# Altium project microdevel_actel.prjpcb
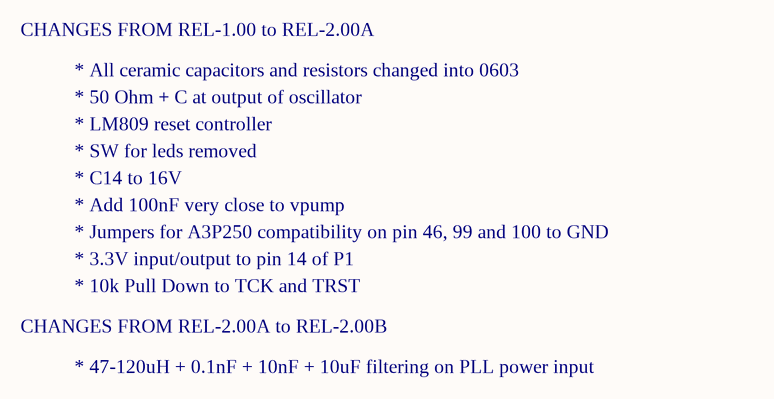
[diagram p0: changelog.schdoc]
3 sheets, 53 parts. Net scope: flat (ports and power ports of the same name join across sheets).
Board file: PCB_microdevel_actel.pcbdoc
Sheets:
  changelog.schdoc
  microdevel_actel.SchDoc
  microdevel_power.schdoc

## Sheet changelog.schdoc
size A4

### Notes on the sheet
- CHANGES FROM REL-1.00 to REL-2.00A
- * All ceramic capacitors and resistors changed into 0603
- * 50 Ohm + C at output of oscillator
- * LM809 reset controller
- * SW for leds removed
- * C14 to 16V
- * Add 100nF very close to vpump
- * Jumpers for A3P250 compatibility on pin 46, 99 and 100 to GND
- * 3.3V input/output to pin 14 of P1
- * 10k Pull Down to TCK and TRST
- CHANGES FROM REL-2.00A to REL-2.00B
- * 47-120uH + 0.1nF + 10nF + 10uF filtering on PLL power input
- Title
- Size:
- Date:
- A4
- Number:
- Time:
- Revision:
- Sheet
- of
- nbee Embedded Systems S.L.
- AV/Carlos V 45 4-D
- Móstoles (Madrid)
- 28938 SPAIN
- +34 91 1201798
- File:

## Sheet microdevel_actel.SchDoc
size A4; Revision: REL-1.1; DocumentName: A3P250 Development Board
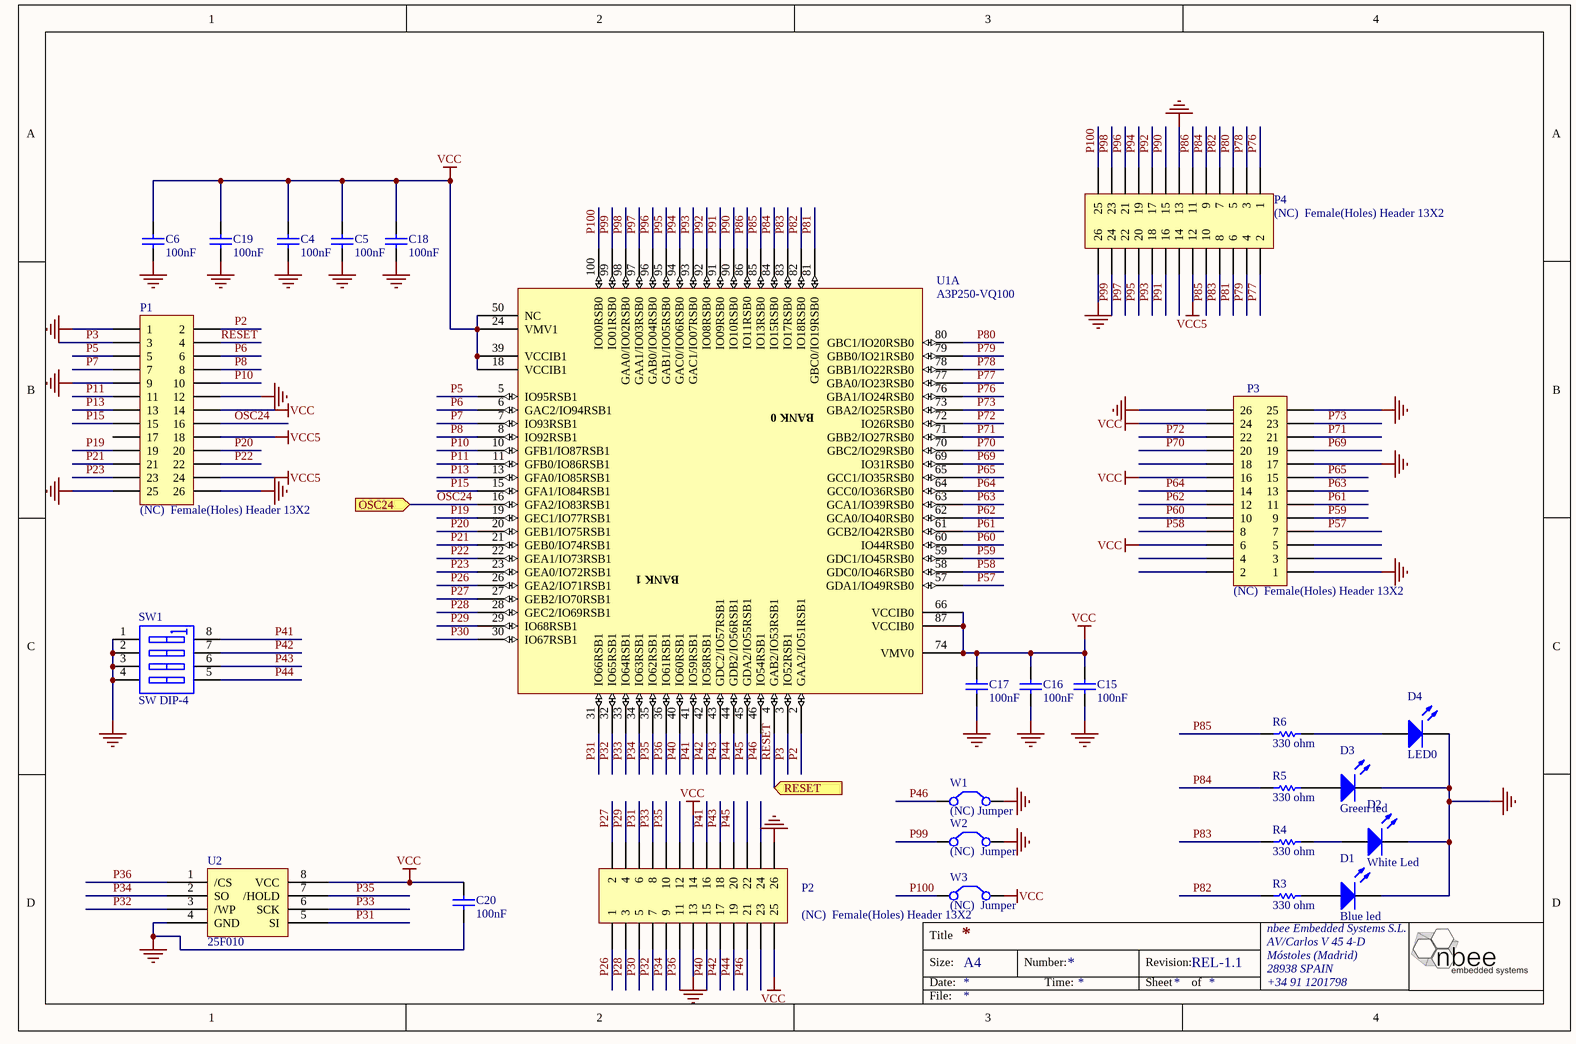
[diagram p1: microdevel_actel.SchDoc]

### Parts
C4  100nF  [0603]
C5  100nF  [0603]
C6  100nF  [0603]
C15  100nF  [0603]
C16  100nF  [0603]
C17  100nF  [0603]
C18  100nF  [0603]
C19  100nF  [0603]
C20  100nF  [0603]
D1  Blue led  [LED_0603]
D2  White Led  [LED_0603]
D3  Green led  [LED_0603]
D4  LED0  [LED_0603]
P1  (NC)  Female(Holes) Header 13X2  [HDR2X13]
P2  (NC)  Female(Holes) Header 13X2  [HDR2X13]
P3  (NC)  Female(Holes) Header 13X2  [HDR2X13]
P4  (NC)  Female(Holes) Header 13X2  [HDR2X13]
R3  330 ohm  [0603]
R4  330 ohm  [0603]
R5  330 ohm  [0603]
R6  330 ohm  [0603]
SW1  SW DIP-4  [SO8]
U1  A3P250-VQ100  [VQ100]  (part A of 2)
U2  25F010  [8S1]
W1  (NC) Jumper  [JUMPER]
W2  (NC)  Jumper  [JUMPER]
W3  (NC)  Jumper  [JUMPER]

### Ports
OSC24 (in), RESET (in)

### Nets
GND: C4.1 C5.1 C6.2 C15.1 C16.1 C17.1 C18.1 C19.1 C20.1 D1.2(K) D2.2(K) D3.2(K) D4.2(K) P1.1 P1.9 P1.12 P1.25 P1.26 P2.13 P2.26 P3.1 P3.17 P3.25 P3.26 P4.13 P4.26 SW1.1(A1) SW1.2(A2) SW1.3(A3) SW1.4(A4) U2.4(GND) W1.2(C2) W2.2(C2)
VCC: C4.2 C5.2 C6.1 C15.2 C16.2 C17.2 C18.2 C19.2 C20.2 P1.14 P2.14 P2.25 P3.6 P3.16 P3.24 U1.18(VCCIB1) U1.24(VMV1) U1.39(VCCIB1) U1.50(NC) U1.66(VCCIB0) U1.74(VMV0) U1.87(VCCIB0) U2.8(VCC) W3.2(C2)
VCC5: P1.18 P1.24 P4.12
OSC24: P1.16 U1.16(GFA2/IO83RSB1) ; port OSC24
P2: P1.2 U1.2(GAA2/IO51RSB1)
P3: P1.3 U1.3(IO52RSB1)
P5: P1.5 U1.5(IO95RSB1)
P6: P1.6 U1.6(GAC2/IO94RSB1)
P7: P1.7 U1.7(IO93RSB1)
P8: P1.8 U1.8(IO92RSB1)
P10: P1.10 U1.10(GFB1/IO87RSB1)
P11: P1.11 U1.11(GFB0/IO86RSB1)
P13: P1.13 U1.13(GFA0/IO85RSB1)
P15: P1.15 U1.15(GFA1/IO84RSB1)
P19: P1.19 U1.19(GEC1/IO77RSB1)
P20: P1.20 U1.20(GEB1/IO75RSB1)
P21: P1.21 U1.21(GEB0/IO74RSB1)
P22: P1.22 U1.22(GEA1/IO73RSB1)
P23: P1.23 U1.23(GEA0/IO72RSB1)
P26: P2.1 U1.26(GEA2/IO71RSB1)
P27: P2.2 U1.27(GEB2/IO70RSB1)
P28: P2.3 U1.28(GEC2/IO69RSB1)
P29: P2.4 U1.29(IO68RSB1)
P30: P2.5 U1.30(IO67RSB1)
P31: P2.6 U1.31(IO66RSB1) U2.5(SI)
P32: P2.7 U1.32(IO65RSB1) U2.3(/WP)
P33: P2.8 U1.33(IO64RSB1) U2.6(SCK)
P34: P2.9 U1.34(IO63RSB1) U2.2(SO)
P35: P2.10 U1.35(IO62RSB1) U2.7(/HOLD)
P36: P2.11 U1.36(IO61RSB1) U2.1(/CS)
P40: P2.15 U1.40(IO60RSB1)
P41: P2.16 SW1.8(B1) U1.41(IO59RSB1)
P42: P2.17 SW1.7(B2) U1.42(IO58RSB1)
P43: P2.18 SW1.6(B3) U1.43(GDC2/IO57RSB1)
P44: P2.19 SW1.5(B4) U1.44(GDB2/IO56RSB1)
P45: P2.20 U1.45(GDA2/IO55RSB1)
P46: P2.21 U1.46(IO54RSB1) W1.1(C1)
P57: P3.7 U1.57(GDA1/IO49RSB0)
P58: P3.8 U1.58(GDC0/IO46RSB0)
P59: P3.9 U1.59(GDC1/IO45RSB0)
P60: P3.10 U1.60(IO44RSB0)
P61: P3.11 U1.61(GCB2/IO42RSB0)
P62: P3.12 U1.62(GCA0/IO40RSB0)
P63: P3.13 U1.63(GCA1/IO39RSB0)
P64: P3.14 U1.64(GCC0/IO36RSB0)
P65: P3.15 U1.65(GCC1/IO35RSB0)
P69: P3.19 U1.69(IO31RSB0)
P70: P3.20 U1.70(GBC2/IO29RSB0)
P71: P3.21 U1.71(GBB2/IO27RSB0)
P72: P3.22 U1.72(IO26RSB0)
P73: P3.23 U1.73(GBA2/IO25RSB0)
P76: P4.1 U1.76(GBA1/IO24RSB0)
P77: P4.2 U1.77(GBA0/IO23RSB0)
P78: P4.3 U1.78(GBB1/IO22RSB0)
P79: P4.4 U1.79(GBB0/IO21RSB0)
P80: P4.5 U1.80(GBC1/IO20RSB0)
P81: P4.6 U1.81(GBC0/IO19RSB0)
P82: P4.7 R3.2 U1.82(IO18RSB0)
P83: P4.8 R4.2 U1.83(IO17RSB0)
P84: P4.9 R5.2 U1.84(IO15RSB0)
P85: P4.10 R6.2 U1.85(IO13RSB0)
P86: P4.11 U1.86(IO11RSB0)
P90: P4.15 U1.90(IO10RSB0)
P91: P4.16 U1.91(IO09RSB0)
P92: P4.17 U1.92(IO08RSB0)
P93: P4.18 U1.93(GAC1/IO07RSB0)
P94: P4.19 U1.94(GAC0/IO06RSB0)
P95: P4.20 U1.95(GAB1/IO05RSB0)
P96: P4.21 U1.96(GAB0/IO04RSB0)
P97: P4.22 U1.97(GAA1/IO03RSB0)
P98: P4.23 U1.98(GAA0/IO02RSB0)
P99: P4.24 U1.99(IO01RSB0) W2.1(C1)
P100: P4.25 U1.100(IO00RSB0) W3.1(C1)
RESET: P1.4 U1.4(GAB2/IO53RSB1) ; port RESET
NetD1_1: D1.1(A) R3.1
NetD2_1: D2.1(A) R4.1
NetD3_1: D3.1(A) R5.1
NetD4_1: D4.1(A) R6.1

Not connected (* = marked no-connect by the designer): P1 17; P2 12 22 23 24; P3 2 3 4 5 18; P4 14

### Notes on the sheet
- Title
- Size:
- Date:
- A4
- Number:
- Time:
- Revision:
- Sheet
- of
- nbee Embedded Systems S.L.
- AV/Carlos V 45 4-D
- Móstoles (Madrid)
- 28938 SPAIN
- +34 91 1201798
- File:
- (in symbol A3P060-1VQ100, part A) BANK 0; BANK 1

### Library data of the parts
C4-C6 C15-C20 = Cap Semi: Capacitor (Semiconductor SIM Model); Published: 8-Jun-2000; LatestRevisionDate: 17-Jul-2002; LatestRevisionNote: Re-released for DXP Platform.; PackageReference: C1206; Publisher: Altium Limited
D1-D3 = LED0: Typical INFRARED GaAs LED; Published: 8-Jun-2000; LatestRevisionDate: 17-Jul-2002; LatestRevisionNote: Re-released for DXP Platform.; Publisher: Altium Limited
D4 = LED0: Red Led; Published: 8-Jun-2000; LatestRevisionDate: 17-Jul-2002; LatestRevisionNote: Re-released for DXP Platform.; Publisher: Altium Limited
P1-P4 = Header 13X2: Header, 13-Pin, Dual row; LatestRevisionDate: 17-Jul-2002; LatestRevisionNote: Re-released for DXP Platform.; Publisher: Altium Limited
R3-R6 = Res1: Resistor; Published: 8-Jun-2000; LatestRevisionDate: 17-Jul-2002; LatestRevisionNote: Re-released for DXP Platform.; Publisher: Altium Limited
SW1 = SW DIP-4: DIP Switch, 4 Position, SPST; Published: 24-Mar-1999; LatestRevisionDate: 17-Jul-2002; LatestRevisionNote: Re-released for DXP Platform.; PackageReference: SO8; Publisher: Altium Limited; Code_JEDEC: MS-012-AA; Code_IPC: SO8
U1 = A3P060-1VQ100: ProASIC3 Flash Family FPGA, 71 User IOs, 60K System Gates, 18 Kbits RAM, 1 Kbit Flash ROM, 1 PLL, 100-Pin VQFP, Commercial Grade; PackageDocument: ver8.7, Jun-2004; Published: 4-Mar-2005; DatasheetDocument: Jan-2005; PackageReference: VQ100; Publisher: Altium Limited; ComponentLink1Description: Flash Devices Home Page; ComponentLink1URL: http://www.actel.com/products/pa3/index.aspx; ComponentLink2Description: Datasheet; ComponentLink2URL: http://www.actel.com/documents/PA3_DS.pdf; ComponentLink3Description: Packaging Specification; ComponentLink3URL: http://www.actel.com/documents/PckgMechDrwngs.pdf; Code_JEDEC: MS-036-AED; Code_IPC: SQFP14X14-100
W1-W3 = Jumper: Jumper Wire; Published: 24-Mar-1999; LatestRevisionDate: 17-Jul-2002; LatestRevisionNote: Re-released for DXP Platform.; PackageReference: RAD-0.2; Publisher: Altium Limited; PackageDescription: Radial Cap, Thru-Hole; 2 Leads; 0.2 in Pin Spacing

## Sheet microdevel_power.schdoc
size A4
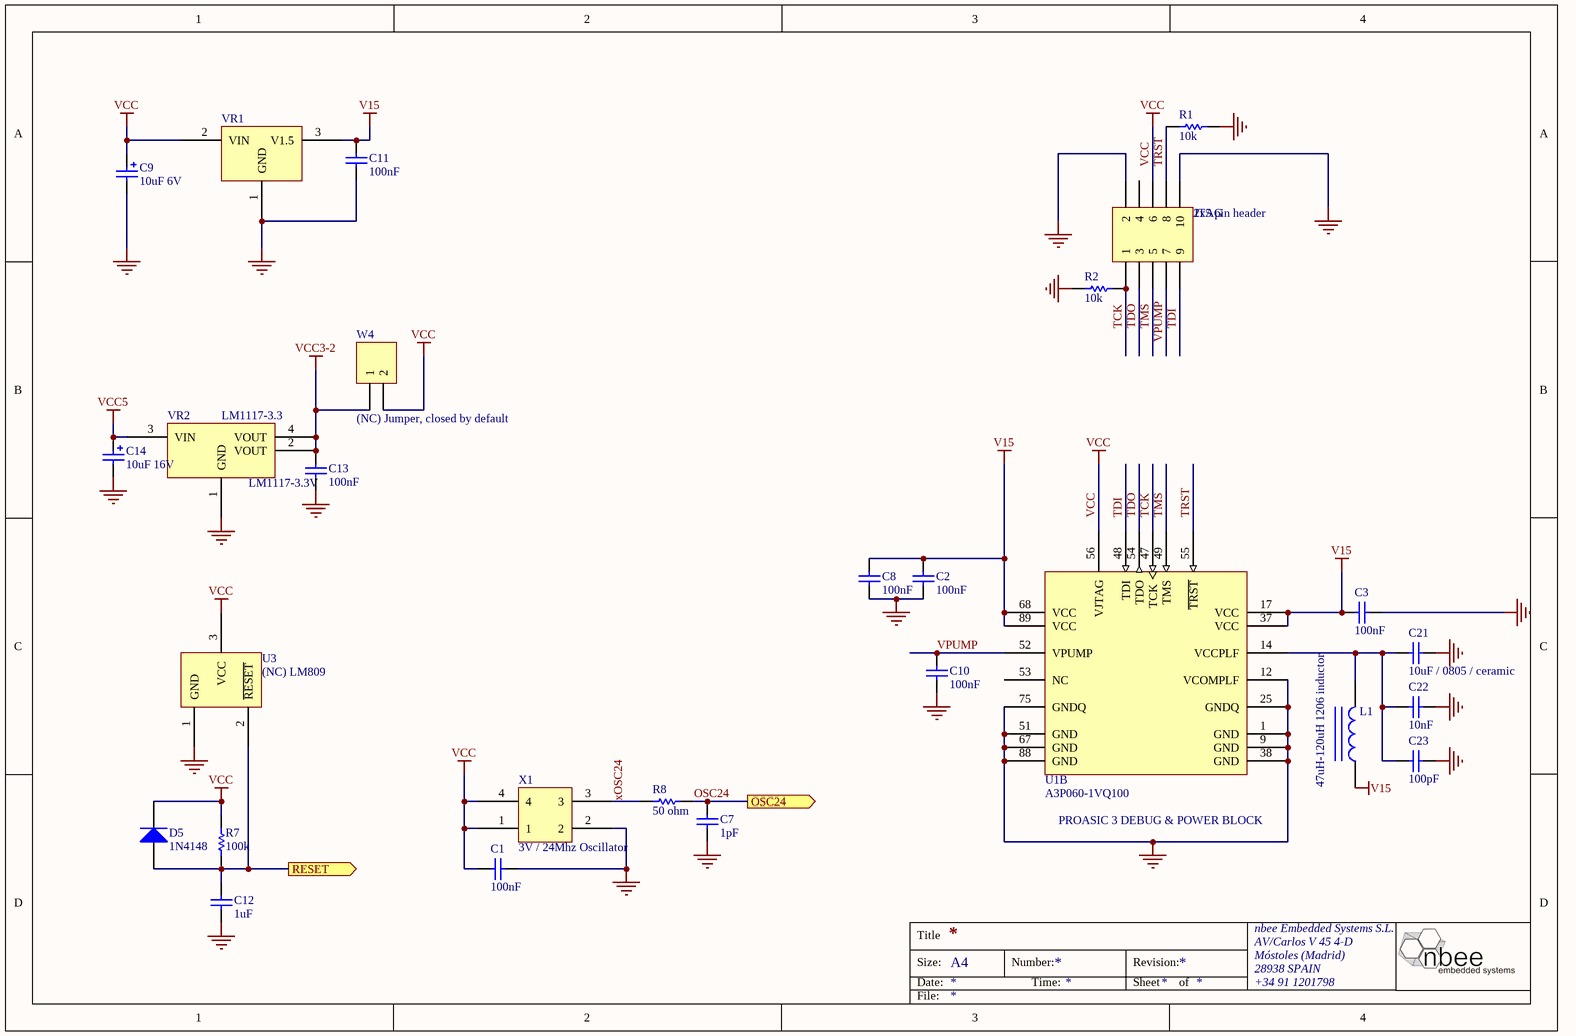
[diagram p2: microdevel_power.schdoc]

### Parts
C1  100nF  [0603]
C2  100nF  [0603]
C3  100nF  [0603]
C7  1pF  [0603]
C8  100nF  [0603]
C9  10uF 6V  [CC-6030]
C10  100nF  [0603]
C11  100nF  [0603]
C12  1uF  [0603]
C13  100nF  [0603]
C14  10uF 16V  [CC-6030]
C21  10uF / 0805 / ceramic  [0805]
C22  10nF  [0603]
C23  100pF  [0603]
D5  1N4148  [DIODE_1206]
JTAG  2x5 pin header  [HDR2X5]
L1  47uH-120uH 1206 inductor  [1206]
R1  10k  [0603]
R2  10k  [0603]
R7  100k  [0603]
R8  50 ohm  [0603]
U1  A3P060-1VQ100  [A3P060]  (part B of 2)
U3  (NC) LM809  [SOT23-2]
VR1  LDO 1.5V  [G4TOB]  (value not drawn)
VR2  LM1117-3.3V  value LM1117-3.3  [DSO-G3]
W4  (NC) Jumper, closed by default  [JUMPER]
X1  3V / 24Mhz Oscillator  [OSC 3x5mm]

### Ports
OSC24 (out), RESET (out)

### Nets
GND: C1.2 C2.1 C3.2 C7.1 C8.1 C9.2 C10.1 C11.1 C12.1 C13.1 C14.2 C21.2 C22.2 C23.2 JTAG.2 JTAG.10 R1.1 R2.1 U1.1(GND) U1.9(GND) U1.12(VCOMPLF) U1.25(GNDQ) U1.38(GND) U1.51(GND) U1.67(GND) U1.75(GNDQ) U1.88(GND) U3.1(GND) VR1.1(GND) VR2.1(GND) X1.2
V15: C2.2 C3.1 C8.2 C11.2 L1.1 U1.17(VCC) U1.37(VCC) U1.68(VCC) U1.89(VCC) VR1.3(V1.5)
VCC: C1.1 C9.1 D5.2(K) JTAG.6 R7.2 U1.56(VJTAG) U3.3(VCC) VR1.2(VIN) W4.2 X1.1 X1.4
VCC3-2: C13.2 VR2.2(VOUT) VR2.4(VOUT) W4.1
VCC5: C14.1 VR2.3(VIN)
OSC24: C7.2 R8.1 ; port OSC24
RESET: C12.2 D5.1(A) R7.1 U3.2(~{RESET}) ; port RESET
TCK: JTAG.1 R2.2 U1.47(TCK)
TDI: JTAG.9 U1.48(TDI)
TDO: JTAG.3 U1.54(TDO)
TMS: JTAG.5 U1.49(TMS)
TRST: JTAG.8 R1.2 U1.55(~{TRST})
VPUMP: C10.2 JTAG.7 U1.52(VPUMP)
xOSC24: R8.2 X1.3
NetC21_1: C21.1 C22.1 C23.1 L1.2 U1.14(VCCPLF)

Not connected (* = marked no-connect by the designer): JTAG 4; U1 53(NC)

### Notes on the sheet
- PROASIC 3 DEBUG & POWER BLOCK
- Title
- Size:
- Date:
- A4
- Number:
- Time:
- Revision:
- Sheet
- of
- nbee Embedded Systems S.L.
- AV/Carlos V 45 4-D
- Móstoles (Madrid)
- 28938 SPAIN
- +34 91 1201798
- File:

### Library data of the parts
C1-C3 C7 C8 C10-C13 C22 C23 = Cap Semi: Capacitor (Semiconductor SIM Model); Published: 8-Jun-2000; LatestRevisionDate: 17-Jul-2002; LatestRevisionNote: Re-released for DXP Platform.; PackageReference: C1206; Publisher: Altium Limited
C9 C14 = Cap Pol3: Polarized Capacitor (Surface Mount); Manufacturer: Generic Components; Class: Passive; Published: 08/06/2000; Publisher: Altium Hobart Technology Centre; SubClass: Capacitor
  C9: Value: 10uF 6V
  C14: Value: 10uF 16V
C21 = Cap Semi: 10uF ceramic capacitor; Published: 8-Jun-2000; LatestRevisionDate: 17-Jul-2002; LatestRevisionNote: Re-released for DXP Platform.; PackageReference: C1206; Publisher: Altium Limited
D5 = Diode: Default Diode; Published: 8-Jun-2000; LatestRevisionDate: 17-Jul-2002; LatestRevisionNote: Re-released for DXP Platform.; PackageDocument: Sep-1996; PackageReference: SMC; Publisher: Altium Limited; Code_JEDEC: DO-214-AB
JTAG = Header 5X2: Header, 5-Pin, Dual row; LatestRevisionDate: 17-Jul-2002; LatestRevisionNote: Re-released for DXP Platform.; Publisher: Altium Limited
L1 = Inductor Iron: Magnetic-Core Inductor; Published: 24-Mar-1999; LatestRevisionDate: 17-Jul-2002; LatestRevisionNote: Re-released for DXP Platform.; PackageReference: AXIAL-0.9; Publisher: Altium Limited; PackageDescription: Axial Device, Thru-Hole; 2 Leads; 0.9 in Pin Spacing; datasheet1: http://www.murata-ps.com/data/magnetics/kmp_2200rm.pdf
R1 R2 R7 R8 = Res1: Resistor; Published: 8-Jun-2000; LatestRevisionDate: 17-Jul-2002; LatestRevisionNote: Re-released for DXP Platform.; Publisher: Altium Limited
U1 = A3P060-1VQ100: as U1 on sheet microdevel_actel; Published: 4-Mar-2005; DatasheetDocument: Jan-2005; PackageReference: VQ100; Publisher: Altium Limited; ComponentLink1Description: Flash Devices Home Page; ComponentLink1URL: http://www.actel.com/products/pa3/index.aspx; ComponentLink2Description: Datasheet; ComponentLink2URL: http://www.actel.com/documents/PA3_DS.pdf; ComponentLink3Description: Packaging Specification; ComponentLink3URL: http://www.actel.com/documents/PckgMechDrwngs.pdf; Code_JEDEC: MS-036-AED; Code_IPC: SQFP14X14-100
U3 = LM809
VR1 = VREG1_5
VR2 = LM1117-3.3
W4 = Header 2H: Header, 2-Pin, Right Angle; LatestRevisionDate: 17-Jul-2002; LatestRevisionNote: Re-released for DXP Platform.; Publisher: Altium Limited
X1 = OSCILATOR

## Nets that join several sheets
GND: microdevel_actel (33 pins), microdevel_power (31 pins)
VCC: microdevel_actel (24 pins), microdevel_power (11 pins)
VCC5: microdevel_actel (P1.18 P1.24 P4.12), microdevel_power (C14.1 VR2.3)
OSC24: microdevel_actel (P1.16 U1.16), microdevel_power (C7.2 R8.1)
RESET: microdevel_actel (P1.4 U1.4), microdevel_power (C12.2 D5.1 R7.1 U3.2)